# EAGLE design Rat Clone V1.0 (EAGLE 9.6.2)
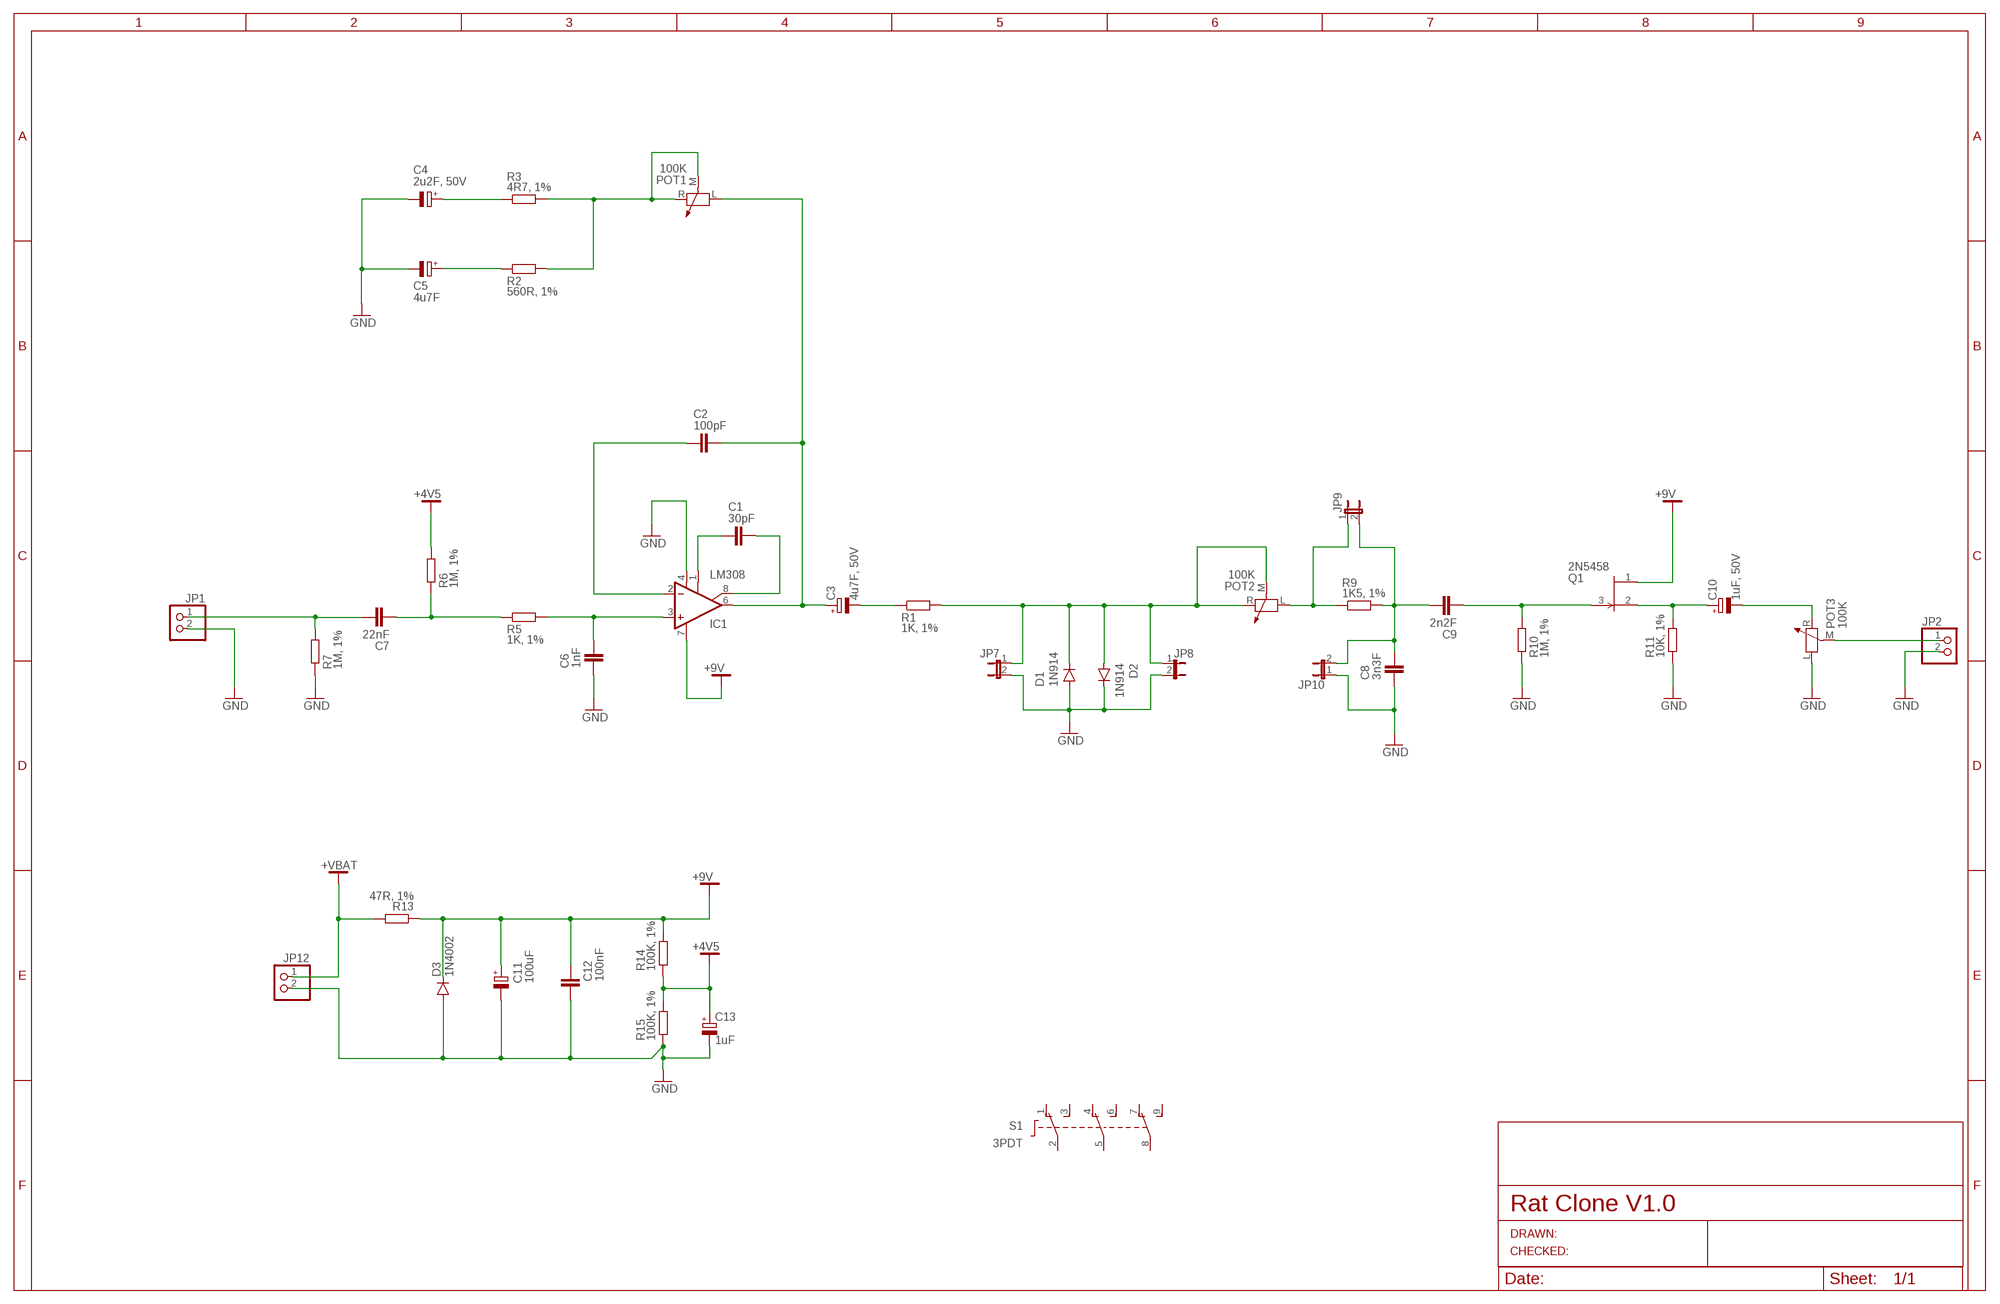
[diagram p0: schematic, sheet 1]

## Parts
C1  30pF  C-EU025-025X050  [C025-025X050]
C2  100pF  C-EU025-025X050  [C025-025X050]
C3  4u7F, 50V  CPOL-EUE2.5-6  [E2,5-6]
C4  2u2F, 50V  CPOL-EUE2.5-6  [E2,5-6]
C5  4u7F  CPOL-EUE2.5-6  [E2,5-6]
C6  1nF  C-EU025-025X050  [C025-025X050]
C7  22nF  C-EU050-025X075  [C050-025X075]
C8  3n3F  C-EU025-025X050  [C025-025X050]
C9  2n2F  C-EU025-025X050  [C025-025X050]
C10  1uF, 50V  CPOL-EUE2.5-6  [E2,5-6]
C11  100uF  CPOL-EUE2.5-5  [E2,5-5]
C12  100nF  C-EU025-025X050  [C025-025X050]
C13  1uF  CPOL-EUE2.5-6  [E2,5-6]
D1  1N914  1N4148DO35-10  [DO35-10]
D2  1N914  1N4148DO35-10  [DO35-10]
D3  1N4002  1N4004  [DO41-10]
IC1  LM308  LM308N  [DIL08]
JP1  PINHD-1X2  [1X02]
JP2  PINHD-1X2  [1X02]
JP7  JP1E  [JP1]
JP8  JP1E  [JP1]
JP9  JP1E  [JP1]
JP10  JP1E  [JP1]
JP12  PINHD-1X2  [1X02]
POT1  100K  WIRED_POT  [MA03-1]
POT2  100K  WIRED_POT  [MA03-1]
POT3  100K  WIRED_POT  [MA03-1]
Q1  2N5458  [TO92-]
R1  1K, 1%  R-EU_0207/7  [0207/7]
R2  560R, 1%  R-EU_0207/7  [0207/7]
R3  4R7, 1%  R-EU_0207/7  [0207/7]
R5  1K, 1%  R-EU_0207/7  [0207/7]
R6  1M, 1%  R-EU_0207/7  [0207/7]
R7  1M, 1%  R-EU_0207/7  [0207/7]
R9  1K5, 1%  R-EU_0207/7  [0207/7]
R10  1M, 1%  R-EU_0207/7  [0207/7]
R11  10K, 1%  R-EU_0207/7  [0207/7]
R13  47R, 1%  R-EU_0207/7  [0207/7]
R14  100K, 1%  R-EU_0207/7  [0207/7]
R15  100K, 1%  R-EU_0207/7  [0207/7]
S1  3PDT  [3PDT]

## Nets
+4V5: C13.+ R6.2 R14.1 R15.2
+9V: C11.+ C12.1 D3.C IC1.7(V+) Q1.1(D) R13.1 R14.2
+VBAT: JP12.1 R13.2
GND: C4.- C5.- C6.1 C8.1 C11.- C12.2 C13.- D1.A D2.C D3.A IC1.4(V-) JP1.2 JP2.2 JP7.2 JP8.2 JP10.1 JP12.2 POT3.L R7.1 R10.1 R11.1 R15.1
N$1: C1.1 IC1.1(CMP1)
N$2: C1.2 IC1.8(CMP2)
N$3: C3.- R1.1
N$4: C2.2 C3.+ IC1.6(OUT) POT1.L
N$5: C2.1 IC1.2(-IN)
N$6: D1.C D2.A JP7.1 JP8.1 POT2.M POT2.R R1.2
N$7: POT1.M POT1.R R2.2 R3.2
N$9: C10.+ Q1.2(S) R11.2
N$10: C5.+ R2.1
N$11: JP9.1 POT2.L R9.1
N$12: C6.2 IC1.3(+IN) R5.2
N$13: C7.1 R5.1 R6.1
N$14: C7.2 JP1.1 R7.2
N$15: C8.2 C9.2 JP9.2 JP10.2 R9.2
N$16: C9.1 Q1.3(G) R10.2
N$17: C10.- POT3.R
N$18: JP2.1 POT3.M
N$21: C4.+ R3.1
Unconnected: S1.1(O1) S1.2(P1) S1.3(S1) S1.4(O2) S1.5(P2) S1.6(S2) S1.7(O3) S1.8(P3) S1.9(S3)

## Library data of the parts
C1 = rcl:C-EU: CAPACITOR, European symbol; MF: KEMET; MPN: C315C300J3G5TA; OC_MOUSER: 80-C315C300J3G5TA; SPICEPREFIX: C
C2 = rcl:C-EU: CAPACITOR, European symbol; MF: Vishay / BC Components; MPN: K101J15C0GF5TL2; OC_MOUSER: 594-K101J15C0GF5TL2; SPICEPREFIX: C
C3 = rcl:CPOL-EU: POLARIZED CAPACITOR, European symbol; DIAMETER: 5mm; MF: MULTICOMP PRO; MPN: MCGPR50V475M5X11; OC_FARNELL: 9451374; SPICEPREFIX: C
C4 = rcl:CPOL-EU: POLARIZED CAPACITOR, European symbol; DIAMETER: 4mm; MF: MULTICOMP PRO; MPN: MCMR50V225M4X7; OC_FARNELL: 1870972; SPICEPREFIX: C
C5 = rcl:CPOL-EU: POLARIZED CAPACITOR, European symbol; DIAMETER: 4mm; MF: MULTICOMP PRO; MPN: MCMR50V475M4X7; OC_FARNELL: 1870974; SPICEPREFIX: C
C6 = rcl:C-EU: CAPACITOR, European symbol; MF: KEMET; MPN: R82EC1100DQ50J; OC_RAPID: 10-5810; SPICEPREFIX: C
C7 = rcl:C-EU: CAPACITOR, European symbol; MF: KEMET; MPN: R82EC2220DQ50JB; OC_RAPID: 10-5822; SPICEPREFIX: C
C8 = rcl:C-EU: CAPACITOR, European symbol; MF: kemet; MPN: R82EC1330DQ50JB; OC_RAPID: 10-5816; SPICEPREFIX: C
C9 = rcl:C-EU: CAPACITOR, European symbol; MF: Faratronic; MPN: C242A222J20C450; OC_RAPID: 08-0302; SPICEPREFIX: C
C10 C13 = rcl:CPOL-EU: POLARIZED CAPACITOR, European symbol; MF: MULTICOMP PRO; MPN: MCGPR50V105M5X11; OC_FARNELL: 9451358; SPICEPREFIX: C
C11 = rcl:CPOL-EU: POLARIZED CAPACITOR, European symbol; MF: KEMET; MPN: ESK107M016AC3AA; OC_MOUSER: 80-ESK107M016AC3AA; SPICEPREFIX: C
C12 = rcl:C-EU: CAPACITOR, European symbol; MF: KEMET; MPN: R82EC3100DQ70JB; OC_RAPID: 10-5826; SPICEPREFIX: C
D1 D2 = diode:1N4148: DIODE high speed (Philips); MF: Fairchild Semiconductor; MPN: 1N914; OC_RAPID: 47-3116
D3 = diode:1N4004: DIODE general purpose rectifier, 1 A; MF: onsemi; MPN: 1N4002G; OC_MOUSER: 863-1N4002G
IC1 = linear:LM308: OP AMP
JP1 JP2 JP12 = pinhead:PINHD-1X2: PIN HEADER; MF: TruConnect; MPN: 20-0134; OC_RAPID: 20-0134
JP7-JP10 = jumper:JP1E: JUMPER
POT1-POT3 = Custom_Pots:WIRED_POT: Pot with header terminals for wiring to PCB
Q1 = transistor-fet:2N5458; MF: Central Semiconductor; MPN: 2N5458 PBFREE; OC_MOUSER: 610-2N5458
R1 R5 = rcl:R-EU_: RESISTOR, European symbol; MF: Royal Ohm; MPN: MF0W4FF1001KIT; OC_RAPID: 62-3450; SPICEPREFIX: R
R2 = rcl:R-EU_: RESISTOR, European symbol; MF: Royal Ohm; MPN: MFF04FF5600KIT; OC_RAPID: 62-3648; SPICEPREFIX: R
R3 = rcl:R-EU_: RESISTOR, European symbol; MF: Royal Ohm; MPN: MF0W4FF470KKIT; OC_RAPID: 62-3404; SPICEPREFIX: R
R6 R7 R10 = rcl:R-EU_: RESISTOR, European symbol; MF: Royal Ohm; MPN: MF0W4FF1004KIT; OC_RAPID: 62-3521; SPICEPREFIX: R
R9 = rcl:R-EU_: RESISTOR, European symbol; MF: Royal Ohm; MPN: MF0W4FF1501KIT; OC_RAPID: 62-3454; SPICEPREFIX: R
R11 = rcl:R-EU_: RESISTOR, European symbol; MF: Royal Ohm; MPN: MF0W4FF1002KIT; OC_RAPID: 62-3474; SPICEPREFIX: R
R13 = rcl:R-EU_: RESISTOR, European symbol; MF: Royal Ohm; MPN: MF006FF470JKIT; OC_RAPID: 62-3540; SPICEPREFIX: R
R14 R15 = rcl:R-EU_: RESISTOR, European symbol; MF: Royal Ohm; MPN: MF0W4FF1003KIT; OC_RAPID: 62-3498; SPICEPREFIX: R
S1 = switch:3PDT: 3PDT 9 pin footswitch SF17020F-0302-21R-L Source: 3PDT.jpg; MF: Taiwan Alpha; MPN: SF17020F-0302-21R-L; OC_RAPID: 78-0746

## Board
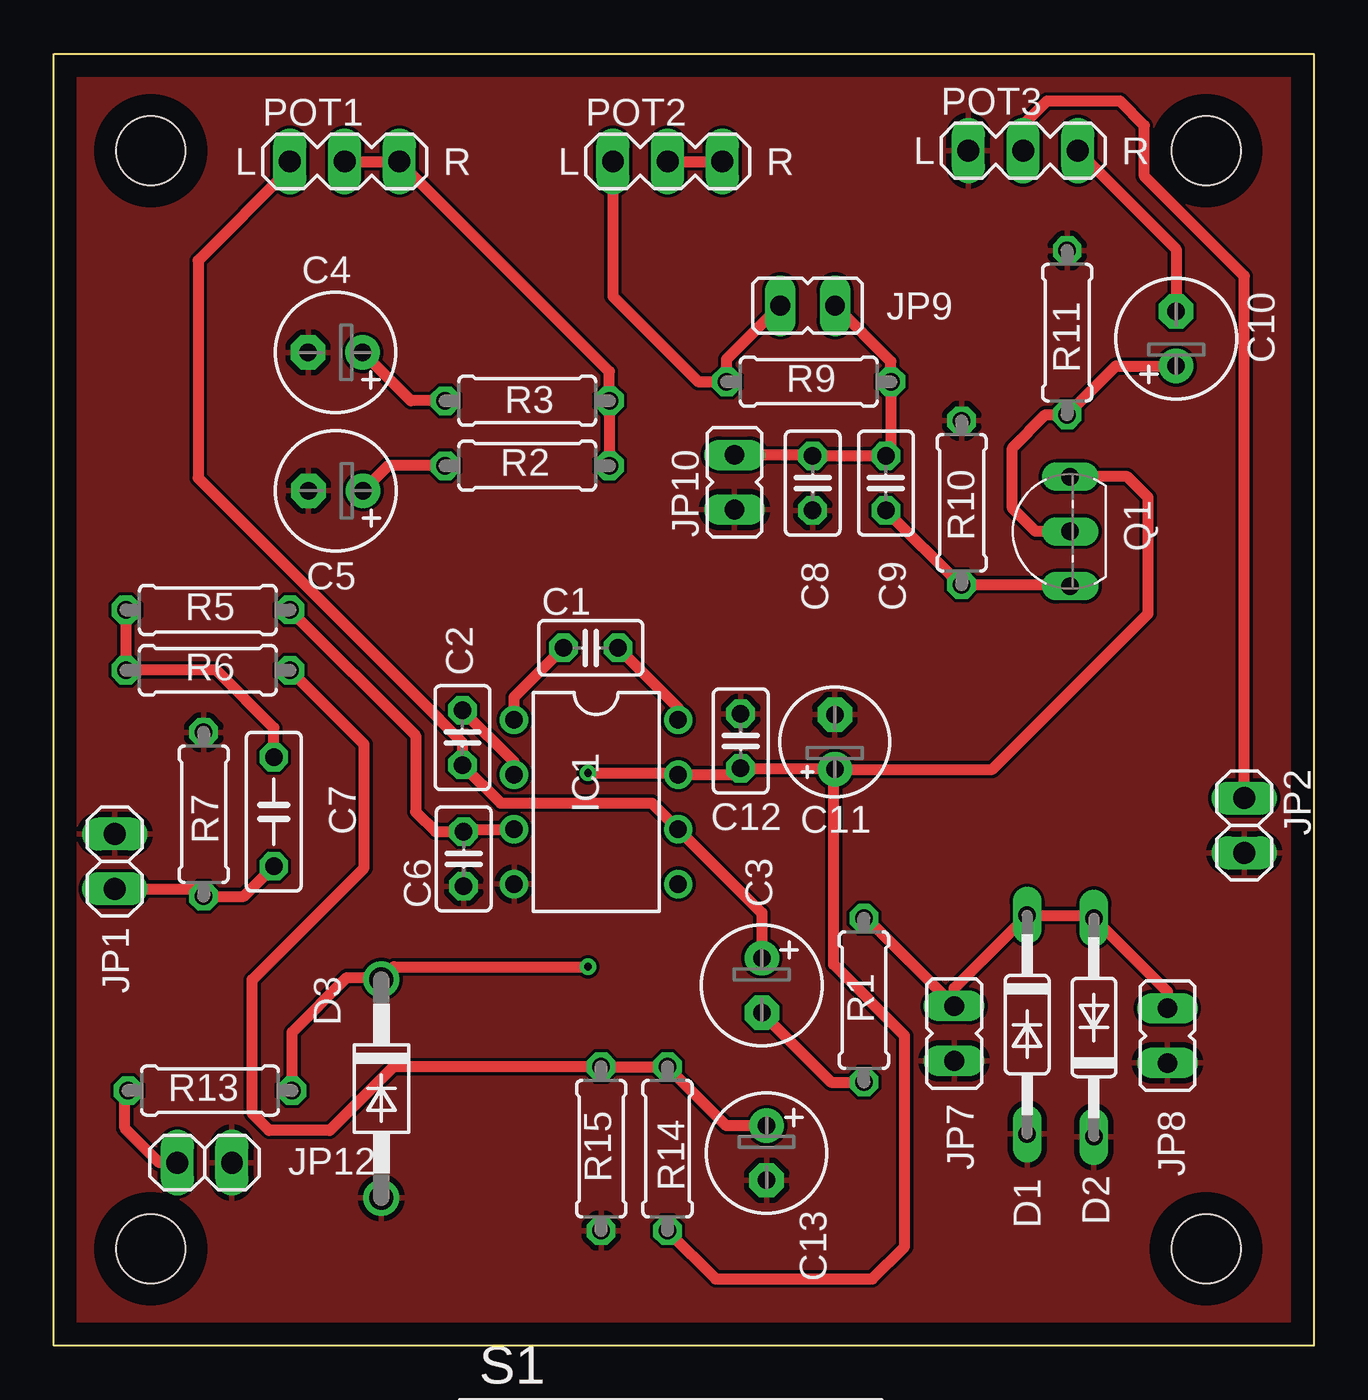
[diagram p1: board, top side]
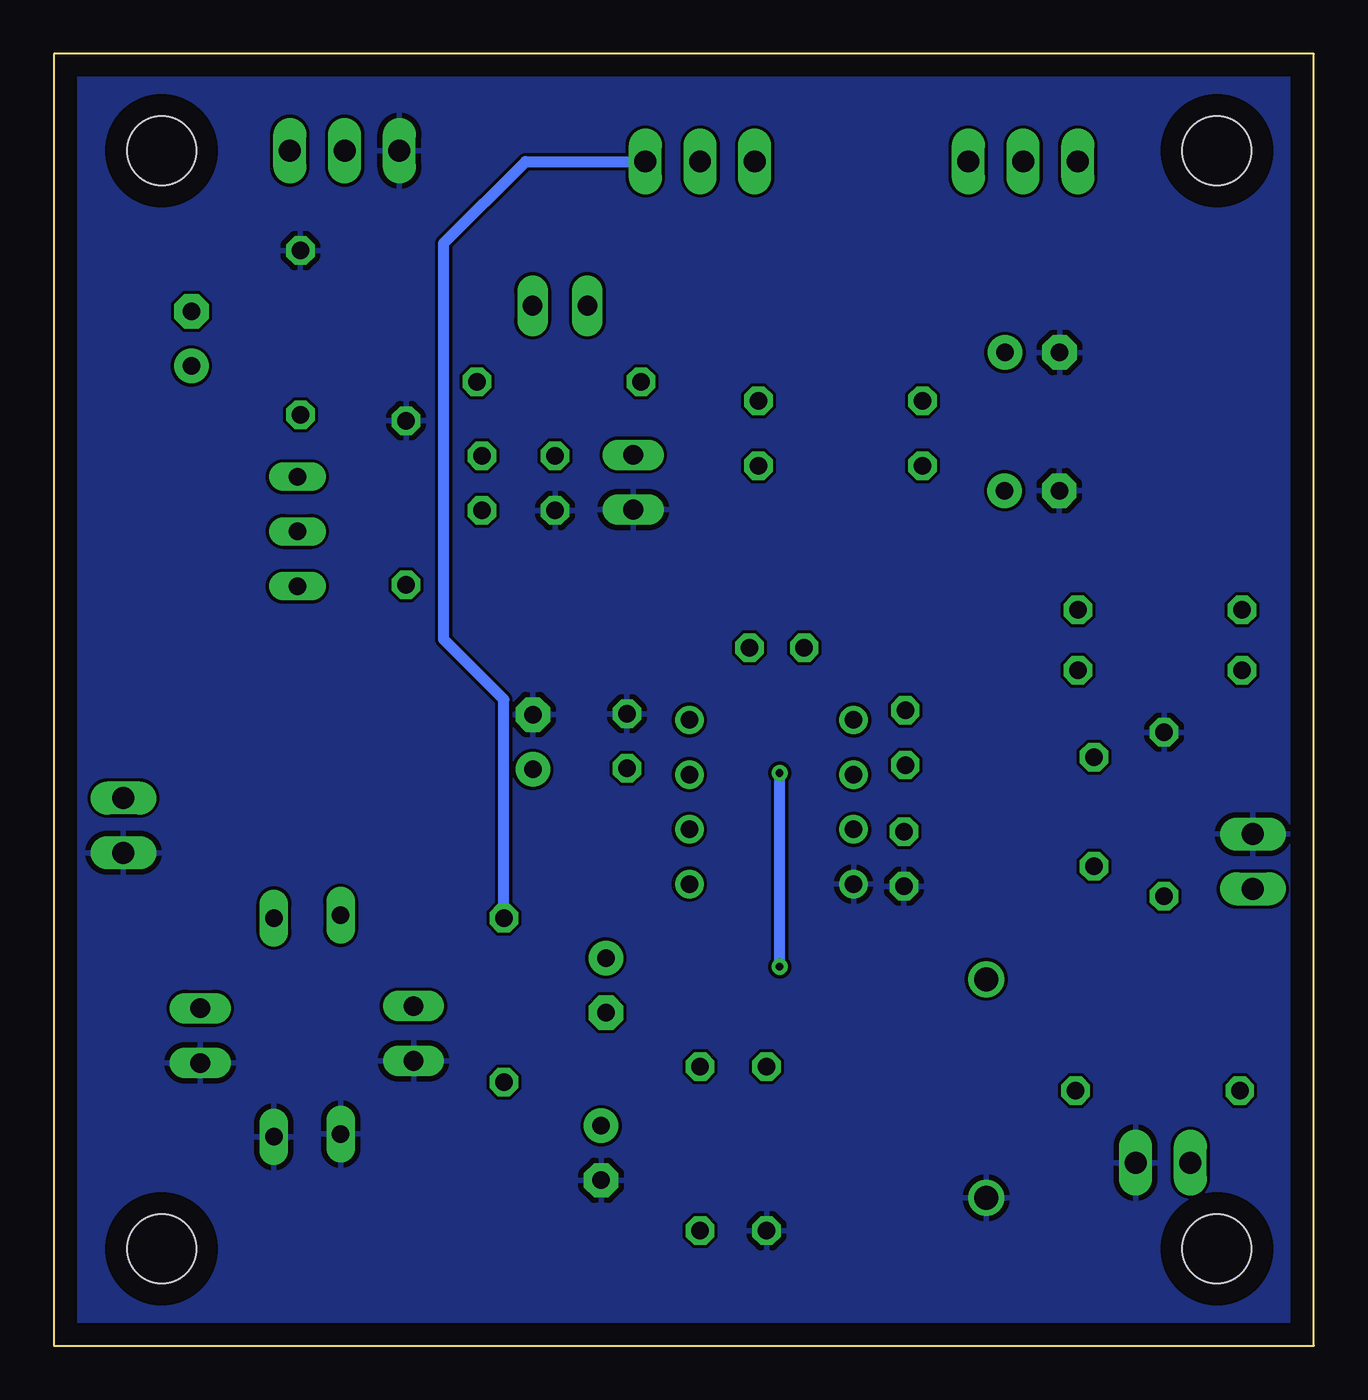
[diagram p2: board, bottom side, seen from below]

Size 58.5 x 60 mm. Coordinates in mm from the lower left corner, seen from the top.
Outline: 0,60 58.5,60 58.5,0 0,0 0,60
Copper layers (1*16): Top 0.035mm / dielectric 1.5mm / Bottom 0.035mm
Design rules "default": minimum track width 6mil, minimum drill 0.35mm, track to track 6mil, track to pad 6mil, pad to pad 6mil, via to via 6mil, smd to smd 6mil, copper to edge 40mil, drill to drill 6mil, minimum pad ring 10mil, minimum via ring 8mil, stop-mask expansion 4mil, vias tented up to drill 0mil, thermal gap 10mil
Holes 3.2 mm at 4.5,55.5 53.5,55.5 4.5,4.5 53.5,4.5

### Footprints (pad centres in the part's own frame; a part is rotated, then mirrored left to right if it is on the bottom)
C025-025X050 = drill 0.813 octagon: 1 -1.27,0; 2 1.27,0
E2,5-6 = drill 0.813 pad 1.6: + -1.27,0 | drill 0.813 pad 1.6 octagon: - 1.27,0
C050-025X075 = drill 0.813 octagon: 1 -2.54,0; 2 2.54,0
E2,5-5 = drill 0.813 pad 1.6: + -1.27,0 | drill 0.813 pad 1.6 octagon: - 1.27,0
DO35-10 = drill 0.813 long: A 5.08,0; C -5.08,0
DO41-10 = drill 1.118: A 5.08,0; C -5.08,0
DIL08 = drill 0.813 pad 1.27: 1 -3.81,-3.81; 2 -1.27,-3.81; 3 1.27,-3.81; 4 3.81,-3.81; 5 3.81,3.81; 6 1.27,3.81; 7 -1.27,3.81; 8 -3.81,3.81
1X02 = drill 1.016 long: 1 -1.27,0; 2 1.27,0
JP1 = drill 0.914 long: 1 0,-1.27; 2 0,1.27
MA03-1 = drill 1.016 long: L -2.54,0; M 0,0; R 2.54,0
TO92- = drill 0.813 long: 1 2.54,0; 2 0,0; 3 -2.54,0
0207/7 = drill 0.813 octagon: 1 -3.81,0; 2 3.81,0
3PDT = drill 2.3 pad 3.1: 1 -5.3,4.8; 2 0,4.8; 3 5.3,4.8; 4 -5.3,0; 5 0,0; 6 5.3,0; 7 -5.3,-4.8; 8 0,-4.8; 9 5.3,-4.8

### Placement (x,y rotation side)
C1  24.93,32.41 0 top
C2  18.97,28.24 270 top
C3  32.87,16.73 270 top
C4  13.07,46.13 180 top
C5  13.09,39.71 180 top
C6  19.03,22.61 90 top
C7  10.21,24.8 270 top
C8  35.23,40.06 90 top
C9  38.63,40.06 90 top
C10  52.11,46.77 90 top
C11  36.26,28.04 90 top
C12  31.89,28.08 90 top
C13  33.09,8.95 270 top
D1  45.19,14.91 270 top
D2  48.29,14.78 90 top
D3  15.21,11.94 270 top
IC1  25.18,25.25 270 top
JP1  2.83,22.49 90 top
JP2  55.27,24.16 270 top
JP7  41.8,14.5 180 top
JP8  51.7,14.4 180 top
JP9  35,48.3 270 top
JP10  31.6,40.1 0 top
JP12  7,8.5 0 top
POT1  13.5,55 0 top
POT2  28.5,55 0 top
POT3  45,55.5 0 top
Q1  47.19,37.82 90 top
R1  37.61,16.05 90 top
R2  21.98,40.87 0 top
R3  21.98,43.89 0 top
R5  7.15,34.17 0 top
R6  7.15,31.37 0 top
R7  6.95,24.68 270 top
R9  35.05,44.77 0 top
R10  42.15,39.15 270 top
R11  47.05,47.05 270 top
R13  7.25,11.85 180 top
R14  28.49,9.15 270 top
R15  25.41,9.15 90 top
S1  28.64,-11.3 0 top  (outside the outline)

### Tracks (layer width: path | path; a pad name or v marks a point on that pad's centre or on a via)
+4V5
  Top 0.5: C13.+ 31.23,10.22 R14.1 R15.2 15.76,12.96 12.8,10 10,10 9.2,10.8 9.2,17 14.4,22.2 14.4,27.93 R6.2
+9V  (via drill 0.35)
  Top 0.5: R13.1 11.06,14.56 13.6,17.1 15.13,17.1 D3.C 15.79,17.6 v24.8,17.6 | 36.22,26.81 C12.1 31.6,26.52 IC1.7 28.91,26.6 v24.8,26.6 | 36.22,26.81 C11.+ 43.57,26.77 50.8,34 50.8,39.4 49.84,40.36 Q1.1 | R14.2 30.73,3.1 38,3.1 39.5,4.6 39.5,14.4 36.2,17.7 36.2,26.79 36.22,26.81
  Bottom 0.5: v24.8,17.6 v24.8,26.6
+VBAT
  Top 0.5: JP12.1 4.9,8.5 3.3,10.1 3.3,11.71 R13.2
GND
  pour Bottom: 0,60 58.5,60 58.5,0 0,0
  pour Top: 0,60 58.5,60 58.5,0 0,0
N$1
  Top 0.5: IC1.1 21.37,30.12 C1.1
N$2
  Top 0.5: C1.2 28.99,29.62 IC1.8
N$3
  Top 0.5: C3.- 36.09,12.24 R1.1
N$4
  Top 0.5: POT1.L 10.96,54.66 6.7,50.4 6.7,40.3 17.91,29.09 17.91,29.07 18.97,28.01 C2.2 20.74,25.2 27.77,25.2 IC1.6 32.87,20.1 C3.+
N$5
  Top 0.5: C2.1 21.37,27.11 IC1.2
N$6
  Top 0.5: POT2.M POT2.R | R1.2 37.71,19.86 JP7.1 41.8,16.6 D1.C 48.16,19.99 D2.A 51.7,16.45 JP8.1
  Bottom 0.5: R1.2 37.61,30.01 40.4,32.8 40.4,51.2 36.6,55 POT2.R
N$7
  Top 0.5: R2.2 R3.2 25.79,45.25 POT1.R POT1.M
N$9
  Top 0.5: Q1.2 45.58,37.82 44.5,38.9 44.5,41.7 46.04,43.24 R11.2 49.31,45.5 C10.+
N$10
  Top 0.5: R2.1 15.52,40.87 C5.+
N$11
  Top 0.5: JP9.1 31.24,45.81 R9.1 29.93,44.77 25.96,48.74 POT2.L
N$12
  Top 0.5: IC1.3 19.13,23.98 C6.2 17.72,23.88 16.8,24.8 16.8,28.33 R5.2
N$13
  Top 0.5: R5.1 R6.1 7.53,31.37 10.21,28.69 C7.1
N$14
  Top 0.5: JP1.1 6.61,21.22 R7.2 8.82,20.87 C7.2
N$15
  Top 0.5: JP9.2 38.86,45.71 R9.2 38.86,41.56 C9.2 C8.2 35.19,41.37 JP10.2
N$16
  Top 0.5: Q1.3 47.13,35.34 R10.2 42.08,35.34 C9.1
N$17
  Top 0.5: POT3.R 52.11,50.93 C10.-
N$18
  Top 0.5: 45,55.4 POT3.M 45,56.7 46.1,57.8 49.5,57.8 50.63,56.67 50.63,54.31 55.27,49.68 JP2.1
N$21
  Top 0.5: R3.1 16.58,43.89 C4.+